# EAGLE schematic Arduino101BiomedDevBoard (EAGLE 8.1.0)
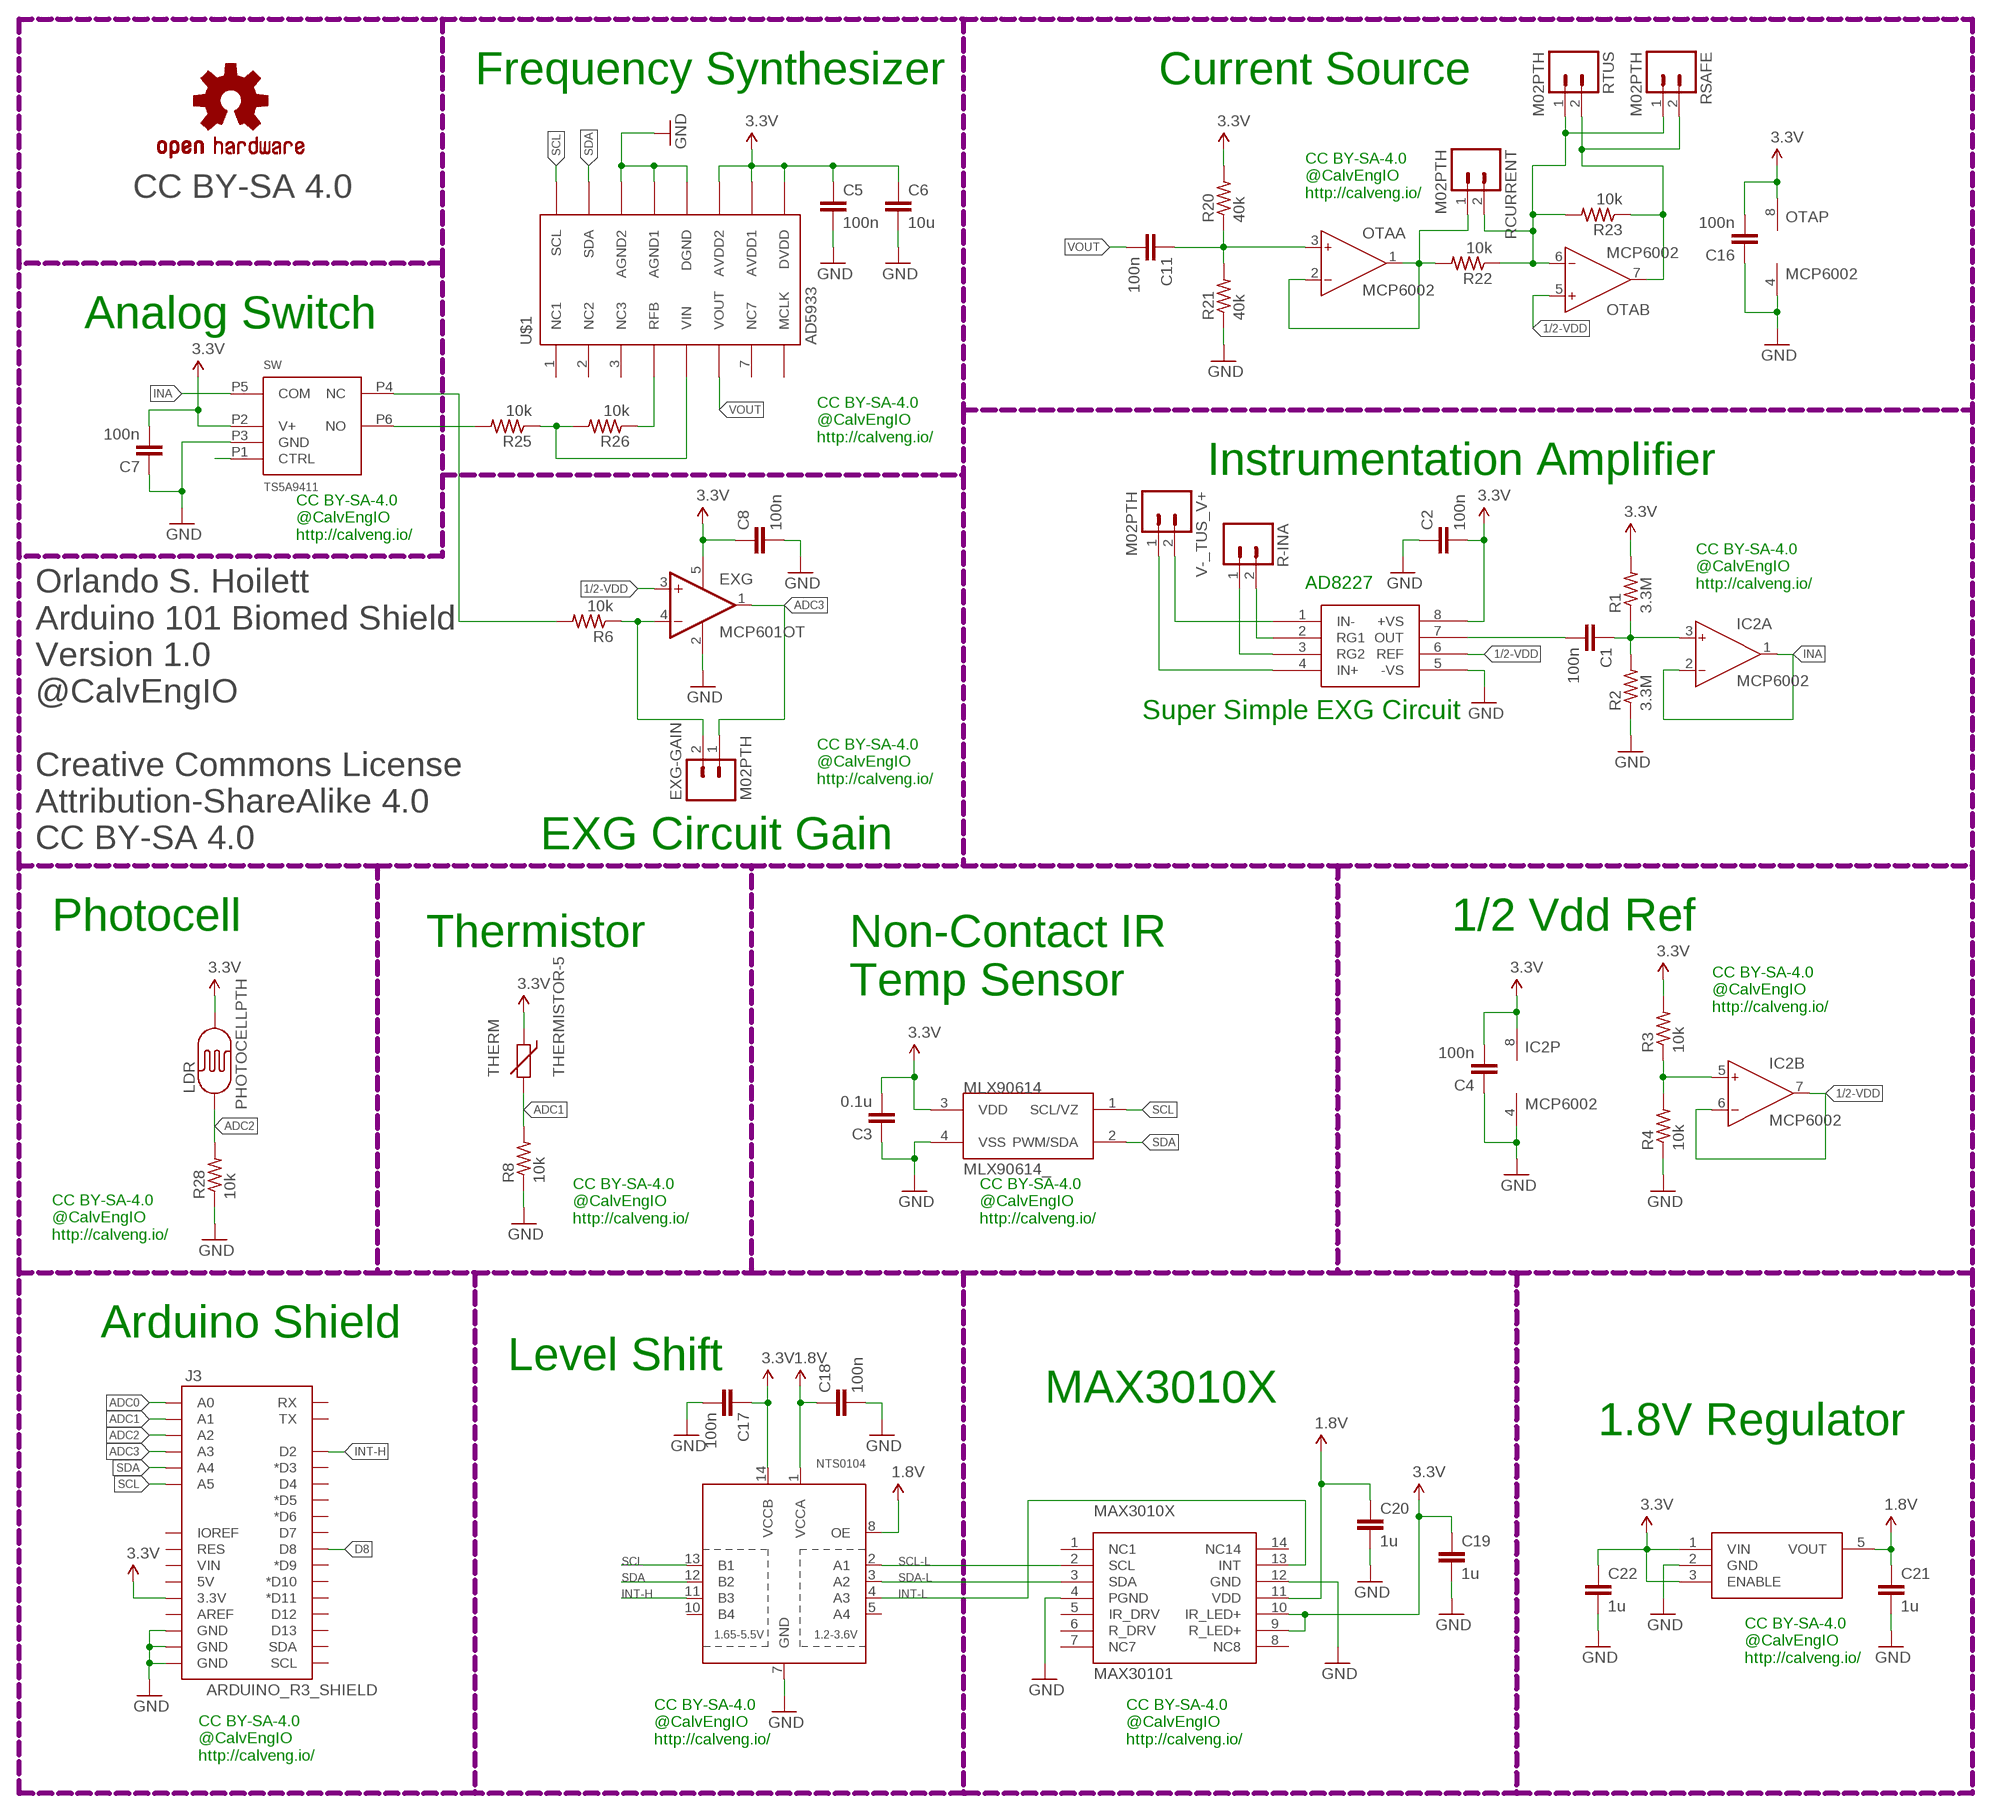
[diagram p0: schematic, sheet 1]

## Parts
1.8V  MIC5504  [SOT23-5]
C1  100n  C-EUC0402  [C0402]
C2  100n  C-EUC0402  [C0402]
C3  0.1u  C-EUC0402  [C0402]
C4  100n  C-EUC0402  [C0402]
C5  100n  C-EUC0402  [C0402]
C6  10u  C-EUC0805  [C0805]
C7  100n  C-EUC0402  [C0402]
C8  100n  C-EUC0402  [C0402]
C11  100n  C-EUC0402  [C0402]
C16  100n  C-EUC0402  [C0402]
C17  100n  C-EUC0402  [C0402]
C18  100n  C-EUC0402  [C0402]
C19  1u  C-EUC0402  [C0402]
C20  1u  C-EUC0402  [C0402]
C21  1u  C-EUC0402  [C0402]
C22  1u  C-EUC0402  [C0402]
EXG  MCP601OT  [SOT23-5]
EXG-GAIN  M02PTH  [1X02]
IC2  MCP6002  AD8607RM  [MSOP08]
INA  AD8220  [MSOP08]
J3  ARDUINO_R3_SHIELD  [UNO_R3_SHIELD]
LDR  PHOTOCELLPTH  [PHOTOCELL]
LOGO3  OSHW-LOGOM  [OSHW-LOGO-M]
MAX3010X  MAX30101  MAX30100  [OESIP14]
MLX90614  MLX90614_  [TO-39]
NTS0104  TXB0104PWR  [TSSOP14]
OTA  MCP6002  AD8607RM  [MSOP08]
R1  3.3M  R-US_R0402  [R0402]
R2  3.3M  R-US_R0402  [R0402]
R3  10k  R-US_R0402  [R0402]
R4  10k  R-US_R0402  [R0402]
R6  10k  R-US_R0402  [R0402]
R8  10k  R-US_R0402  [R0402]
R20  40k  R-US_R0402  [R0402]
R21  40k  R-US_R0402  [R0402]
R22  10k  R-US_R0402  [R0402]
R23  10k  R-US_R0402  [R0402]
R25  10k  R-US_R0402  [R0402]
R26  10k  R-US_R0402  [R0402]
R28  10k  R-US_R0402  [R0402]
R-INA  M02PTH  [1X02]
RCURRENT  M02PTH  [1X02]
RSAFE  M02PTH  [1X02]
RTUS  M02PTH  [1X02]
SW  TS5A9411  [SOT-363]
THERM  THERMISTOR-5  [R-5]
U$1  AD5933  [SSOP-16]
V-_TUS_V+  M02PTH  [1X02]

## Nets
1.8V: 1.8V.5(VOUT) C18.1 C20.1 C21.1 MAX3010X.11(VDD) NTS0104.1(VCCA) NTS0104.8(OE)
1/2-VDD: EXG.3(+IN) IC2.6(B:IN-) IC2.7(B:OUT) INA.6(REF) OTA.5(B:IN+)
3.3V: 1.8V.1(VIN) 1.8V.3(ENABLE) C2.2 C3.2 C4.2 C5.1 C6.1 C7.2 C8.1 C16.2 C17.1 C19.1 C22.1 EXG.5(V+) IC2.8(P:V+) INA.8(+VS) J3.3.3V LDR.2 MAX3010X.9(R_LED+) MAX3010X.10(IR_LED+) MLX90614.3(VDD) NTS0104.14(VCCB) OTA.8(P:V+) R1.2 R3.2 R20.2 SW.P2(V+) THERM.1 U$1.9(DVDD) U$1.10(AVDD1) U$1.11(AVDD2)
ADC0: J3.A0
ADC1: J3.A1 R8.2 THERM.2
ADC2: J3.A2 LDR.1 R28.2
ADC3: EXG-GAIN.1 EXG.1(OUT) J3.A3
D8: J3.D8 SW.P1(CTRL)
GND: 1.8V.2(GND) C2.1 C3.1 C4.1 C5.2 C6.2 C7.1 C8.2 C16.1 C17.2 C18.2 C19.2 C20.2 C21.2 C22.2 EXG.2(V-) IC2.4(P:V-) INA.5(-VS) J3.GND@0(GND) J3.GND@1(GND) J3.GND@2(GND) MAX3010X.4(PGND) MAX3010X.12(GND) MLX90614.4(VSS) NTS0104.7(GND) OTA.4(P:V-) R2.1 R4.1 R8.1 R21.1 R28.1 SW.P3(GND) U$1.12(DGND) U$1.13(AGND1) U$1.14(AGND2)
INA: IC2.1(A:OUT) IC2.2(A:IN-) SW.P5(COM)
INT-H: J3.D2 NTS0104.11(B3)
INT-L: MAX3010X.13(INT) NTS0104.4(A3)
N$1: C1.1 IC2.3(A:IN+) R1.1 R2.2
N$3: C1.2 INA.7(OUT)
N$4: IC2.5(B:IN+) R3.1 R4.2
N$6: INA.3(RG2) R-INA.1
N$7: EXG-GAIN.2 EXG.4(-IN) R6.1
N$9: C11.1 OTA.3(A:IN+) R20.1 R21.2
N$10: R25.2 SW.P6(NO)
N$12: R25.1 R26.2 U$1.5(VIN)
N$13: R6.2 SW.P4(NC)
N$14: OTA.1(A:OUT) OTA.2(A:IN-) R22.2 RCURRENT.1
N$16: OTA.6(B:IN-) R22.1 R23.2 RCURRENT.2 RSAFE.1 RTUS.1
N$17: OTA.7(B:OUT) R23.1 RSAFE.2 RTUS.2
N$18: INA.1(IN-) V-_TUS_V+.2
N$19: INA.4(IN+) V-_TUS_V+.1
N$20: INA.2(RG1) R-INA.2
N$24: R26.1 U$1.4(RFB)
SCL: J3.A5 MLX90614.1(SCL/VZ) NTS0104.13(B1) U$1.16(SCL)
SCL-L: MAX3010X.2(SCL) NTS0104.2(A1)
SDA: J3.A4 MLX90614.2(PWM/SDA) NTS0104.12(B2) U$1.15(SDA)
SDA-L: MAX3010X.3(SDA) NTS0104.3(A2)
VOUT: C11.2 U$1.6(VOUT)
Unconnected: J3.5V J3.AREF J3.D3(*D3) J3.D4 J3.D5(*D5) J3.D6(*D6) J3.D7 J3.D9(*D9) J3.D10(*D10) J3.D11(*D11) J3.D12 J3.D13 J3.IOREF J3.RES J3.RX J3.SCL J3.SDA J3.TX J3.VIN MAX3010X.1(NC1) MAX3010X.5(IR_DRV) MAX3010X.6(R_DRV) MAX3010X.7(NC7) MAX3010X.8(NC8) MAX3010X.14(NC14) NTS0104.5(A4) NTS0104.10(B4) U$1.1(NC1) U$1.2(NC2) U$1.3(NC3) U$1.7(NC7) U$1.8(MCLK)

## Notes on the sheet
- Frequency Synthesizer | Current Source
- CC BY-SA 4.0
- CC BY-SA-4.0
  @CalvEngIO
  http://calveng.io/
- Analog Switch
- CC BY-SA-4.0
  @CalvEngIO
  http://calveng.io/
- Instrumentation Amplifier
- CC BY-SA-4.0
  @CalvEngIO
  http://calveng.io/
- AD8227
- CC BY-SA-4.0
  @CalvEngIO
  http://calveng.io/
- Super Simple EXG Circuit
- CC BY-SA-4.0
  @CalvEngIO
  http://calveng.io/
- Orlando S. Hoilett
  Arduino 101 Biomed Shield
  Version 1.0
  @CalvEngIO
  
  Creative Commons License
  Attribution-ShareAlike 4.0
  CC BY-SA 4.0
- EXG Circuit Gain
- Photocell | 1/2 Vdd Ref
- Thermistor
- Non-Contact IR
  Temp Sensor
- CC BY-SA-4.0
  @CalvEngIO
  http://calveng.io/
- CC BY-SA-4.0
  @CalvEngIO
  http://calveng.io/
- CC BY-SA-4.0
  @CalvEngIO
  http://calveng.io/
- CC BY-SA-4.0
  @CalvEngIO
  http://calveng.io/
- Arduino Shield
- Level Shift
- MAX3010X
- 1.8V Regulator
- CC BY-SA-4.0
  @CalvEngIO
  http://calveng.io/
- CC BY-SA-4.0
  @CalvEngIO
  http://calveng.io/
- CC BY-SA-4.0
  @CalvEngIO
  http://calveng.io/
- CC BY-SA-4.0
  @CalvEngIO
  http://calveng.io/

## Library data of the parts
1.8V = OrlandoRonMod:MIC5504
C1-C8 C11 C16-C22 = resistor:C-EU: CAPACITOR, European symbol
EXG = linear:MCP601: Single Op Amp 2.7V to 6.0V Single Supply CMOS Source: http://ww1.microchip.com/downloads/en/DeviceDoc/21314g.pdf
EXG-GAIN R-INA RCURRENT RSAFE RTUS V-_TUS_V+ = SparkFun-Connectors:M02: Standard 2-pin 0.1" header. Use with - straight break away headers ( PRT-00116) - right angle break away headers (PRT-00553) - swiss pins (PRT-00743) - machine pins (PRT-00117) - female headers (PRT-00115) Molex polarized connector foot print use with: PRT-08233 with associated crimp pins and housings. 2.54_SCREWTERM for use with PRT-10571. 3.5mm Screw Terminal footprints for PRT-08084 5mm Screw Terminal footprints for use with PRT-08432
IC2 OTA = analog-devices:AD8607: Precision Micropower, Low Noise CMOS, Rail-to-Rail Input/Output Operational Amplifiers Source: http://www.analog.com/static/imported-files/data_sheets/AD8603_8607_8609.pdf; MF: ALTERA CORPORATION; MPN: AD8607ARMZ-REEL; OC_FARNELL: 1464990; OC_NEWARK: 59K6925
INA = Orlando:AD8220
J3 = SparkFun-Boards:ARDUINO_R3_SHIELD: Shield form compatible with the Arduino Uno R3.
LDR = SparkFun-Sensors:PHOTOCELL: CdS photoresistor. This is a low cost way to detect light levels. Resistance decreases with more incoming light. SparkFun SKU: SEN-09088
LOGO3 = SparkFun-Aesthetics:OSHW-LOGO: Open Source Hardware Logo This logo indicates the piece of hardware it is found on incorporates a OSHW license and/or adheres to the definition of open source hardware found here: http://freedomdefined.org/OSHW
MAX3010X = OrlandoRonMod:MAX30100
MLX90614 = SparkFun-Sensors:MLX90614: Non-contact PIR I2C interface temperature sensor
NTS0104 = SparkFun-DigitalIC:TXB0104PWR: 4-Bit Bi-Directional Level Shifter 1.2V-3.6V (VCCA) to 1.65V-5.5V (VCCB) bi-directional level shifter with auto direction sensing. Max data rate - VCCA 1.8V: 20Mbps (50ns), VCCA 3.3V: 100Mbps (10ns) Digikey: 296-21929-1-ND (TSSOP) IC-11329
R1-R4 R6 R8 R20-R23 R25 R26 R28 = resistor:R-US_: RESISTOR, American symbol
SW = Orlando:TS5A9411
THERM = varistor:THERMISTOR: THERMISTOR
U$1 = Orlando:AD5933

## Net classes
0 default: width 0.152 mm, drill 0.305 mm, clearance 0.152 mm